# Altium project Stm32F4.PrjPcb
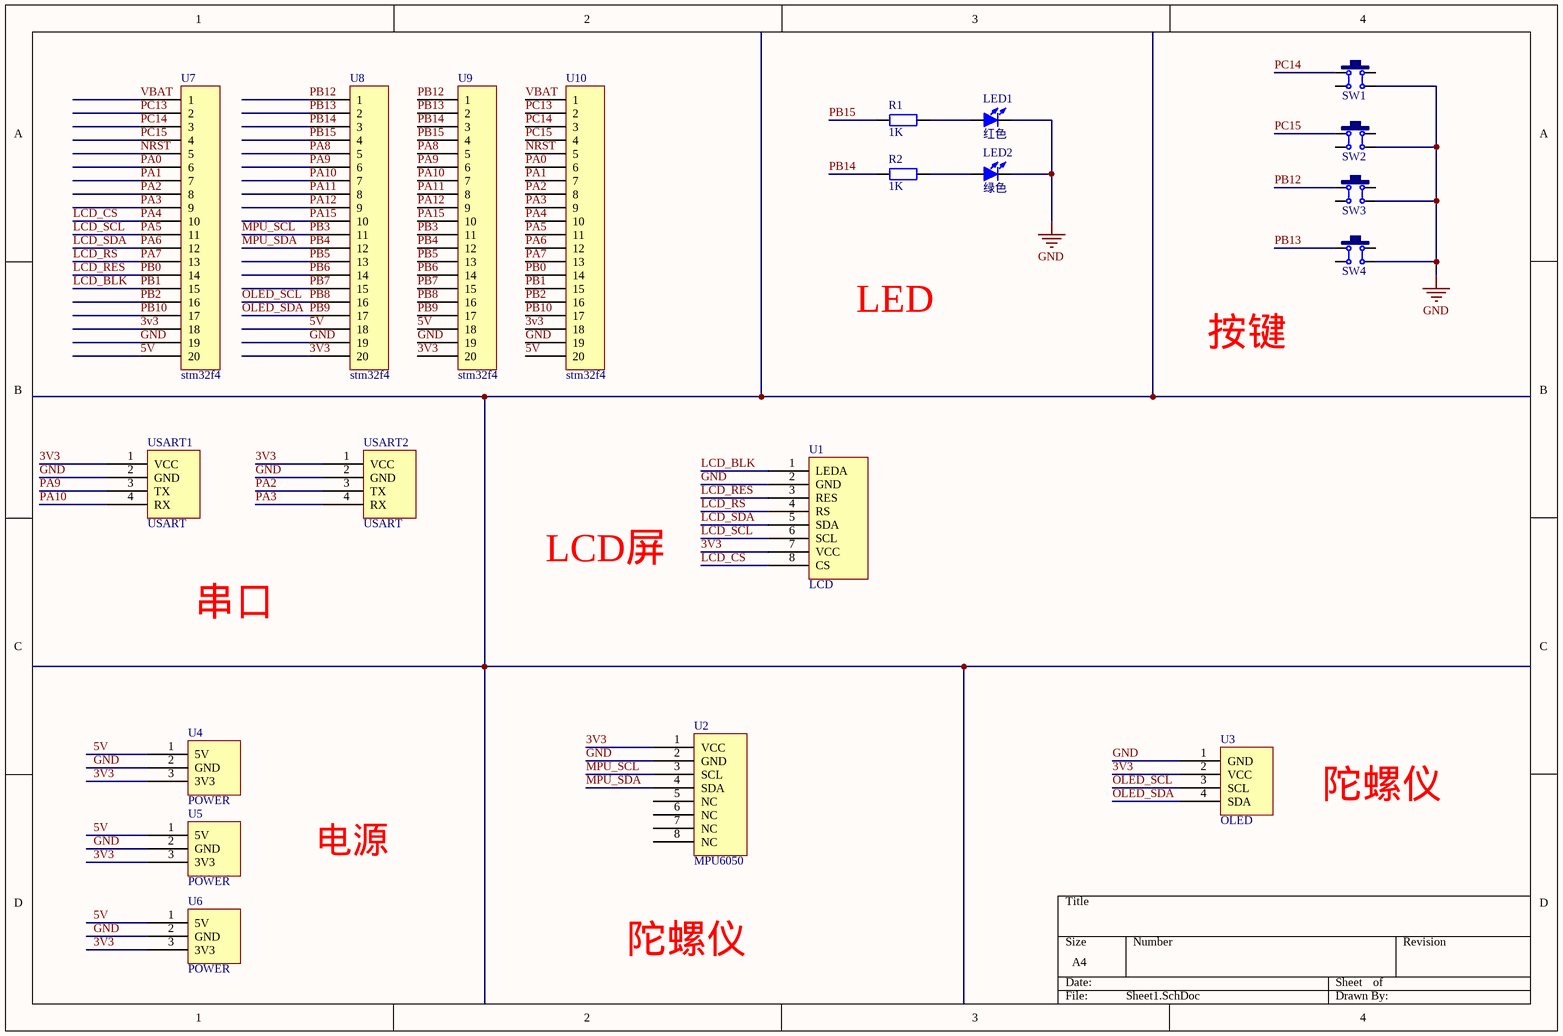
[diagram p0: Sheet1.SchDoc]
1 sheet, 20 parts. Net scope: global (net labels, ports and power ports of the same name join across sheets).
Board file: PCB1.PcbDoc

## Sheet Sheet1.SchDoc
size A4

### Parts
LED1  红色  [LED 0805G]
LED2  绿色  [LED 0805G]
R1  1K  [R 0603_L]
R2  1K  [R 0603_L]
SW1  6x6x5  [TSW DIP-6*6*6]  (value not drawn)
SW2  6x6x5  [TSW DIP-6*6*6]  (value not drawn)
SW3  6x6x5  [TSW DIP-6*6*6]  (value not drawn)
SW4  6x6x5  [TSW DIP-6*6*6]  (value not drawn)
U1  LCD  [FPC]
U2  MPU6050  [8PIN]
U3  OLED  [4PIN]
U4  POWER  [3PIN]
U5  POWER  [3PIN]
U6  POWER  [3PIN]
U7  stm32f4  [20PIN]
U8  stm32f4  [20PIN]
U9  stm32f4  [20PIN]
U10  stm32f4  [20PIN]
USART1  USART  [4PIN]
USART2  USART  [4PIN]

### Nets
GND: LED1.2(K) LED2.2(K) SW1.3 SW2.3 SW3.3 SW4.3 U1.2(GND) U2.2(GND) U3.1(GND) U4.2(GND) U5.2(GND) U6.2(GND) U7.19 U8.19 U9.19 U10.19 USART1.2(GND) USART2.2(GND)
3V3: U1.7(VCC) U2.1(VCC) U3.2(VCC) U4.3(3V3) U5.3(3V3) U6.3(3V3) U7.18 U8.20 U9.20 U10.18 USART1.1(VCC) USART2.1(VCC)
5V: U4.1(5V) U5.1(5V) U6.1(5V) U7.20 U8.18 U9.18 U10.20
LCD_BLK: U1.1(LEDA) U7.15 U10.15  [also labelled PB1]
LCD_CS: U1.8(CS) U7.10 U10.10  [also labelled PA4]
LCD_RES: U1.3(RES) U7.14 U10.14  [also labelled PB0]
LCD_RS: U1.4(RS) U7.13 U10.13  [also labelled PA7]
LCD_SCL: U1.6(SCL) U7.11 U10.11  [also labelled PA5]
LCD_SDA: U1.5(SDA) U7.12 U10.12  [also labelled PA6]
MPU_SCL: U2.3(SCL) U8.11 U9.11  [also labelled PB3]
MPU_SDA: U2.4(SDA) U8.12 U9.12  [also labelled PB4]
NRST: U7.5 U10.5
OLED_SCL: U3.3(SCL) U8.16 U9.16  [also labelled PB8]
OLED_SDA: U3.4(SDA) U8.17 U9.17  [also labelled PB9]
PA0: U7.6 U10.6
PA1: U7.7 U10.7
PA2: U7.8 U10.8 USART2.3(TX)
PA3: U7.9 U10.9 USART2.4(RX)
PA8: U8.5 U9.5
PA9: U8.6 U9.6 USART1.3(TX)
PA10: U8.7 U9.7 USART1.4(RX)
PA11: U8.8 U9.8
PA12: U8.9 U9.9
PA15: U8.10 U9.10
PB2: U7.16 U10.16
PB5: U8.13 U9.13
PB6: U8.14 U9.14
PB7: U8.15 U9.15
PB10: U7.17 U10.17
PB12: SW3.1 U8.1 U9.1
PB13: SW4.1 U8.2 U9.2
PB14: R2.1 U8.3 U9.3
PB15: R1.1 U8.4 U9.4
PC13: U7.2 U10.2
PC14: SW1.1 U7.3 U10.3
PC15: SW2.1 U7.4 U10.4
VBAT: U7.1 U10.1
NetLED1_1: LED1.1(A) R1.2
NetLED2_1: LED2.1(A) R2.2

Not connected (* = marked no-connect by the designer): SW1 2 4; SW2 2 4; SW3 2 4; SW4 2 4; U2 5(NC) 6(NC) 7(NC) 8(NC)

### Notes on the sheet
- LED
- 按键
- LCD屏
- 串口
- 陀螺仪
- 电源

### Library data of the parts
LED1 LED2 = LED-SMD: 贴片LED; 版权归属: 源创客; BOM名称: 贴片LED; 学习资源: www.ooocke.com
R1 R2 = R: 贴片电阻; 版权归属: 源创客; BOM名称: 贴片电阻; 学习资源: www.ooocke.com
SW1-SW4 = TSW DIP-6x6: 直插6x6轻触开关; 版权归属: 源创客; BOM名称: 直插6x6轻触开关; 学习资源: www.ooocke.com
U1 = LCD: 屏幕接口
U2 = MPU6050: 陀螺仪